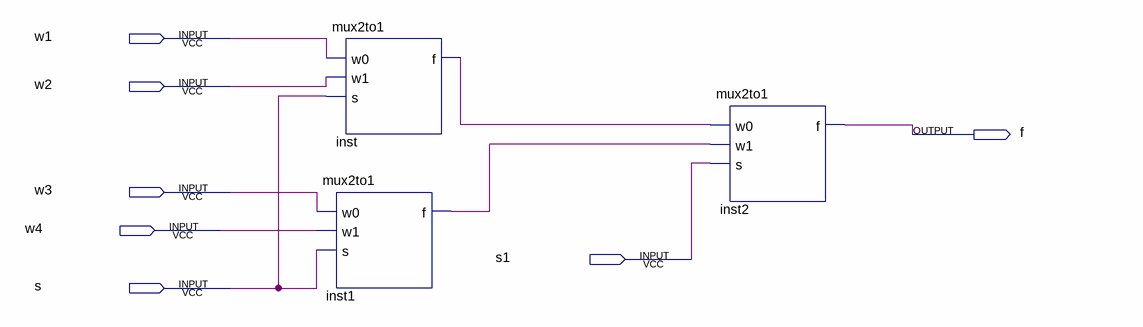
[diagram p0: schematic sheet]
// Quartus schematic muxBlock.bdf as structural Verilog: 3 symbols, 7 pins
module muxBlock (
  input  w1,
  input  w2,
  input  w3,
  input  w4,
  input  s1,
  input  s,
  output f
);

  wire inst1_f, inst_f;

  mux2to1 inst (.w0(w1), .w1(w2), .s(s), .f(inst_f));
  mux2to1 inst1 (.w0(w3), .w1(w4), .s(s), .f(inst1_f));
  mux2to1 inst2 (.w0(inst_f), .w1(inst1_f), .s(s1), .f(f));
endmodule
